# EAGLE design ATTiny85 (EAGLE 9.6.2)
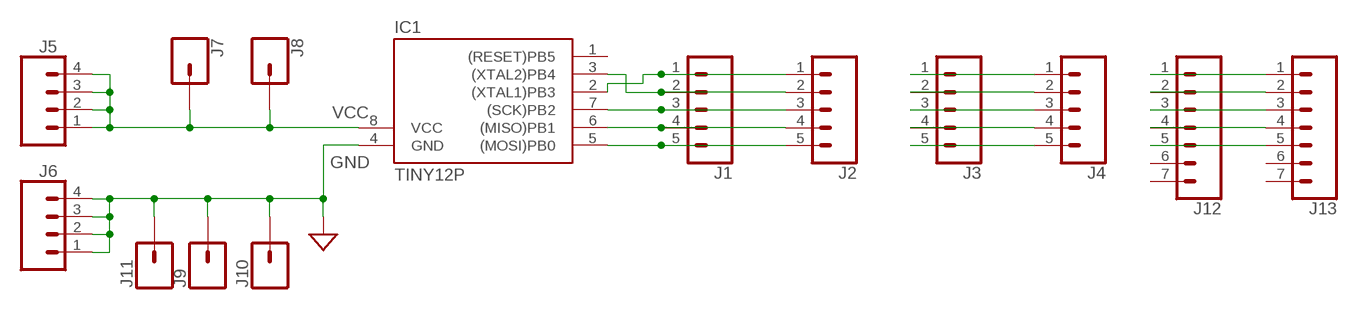
[diagram p0: schematic, sheet 1]

## Parts
IC1  TINY12P  [DIL08]
J1  CONN_05NO_SILK  [1X05_NO_SILK]
J2  CONN_05NO_SILK  [1X05_NO_SILK]
J3  CONN_05NO_SILK  [1X05_NO_SILK]
J4  CONN_05NO_SILK  [1X05_NO_SILK]
J5  CONN_041X04_NO_SILK  [1X04_NO_SILK]
J6  CONN_041X04_NO_SILK  [1X04_NO_SILK]
J7  CONN_01PTH_NO_SILK_KIT  [1X01NS_KIT]
J8  CONN_01PTH_NO_SILK_KIT  [1X01NS_KIT]
J9  CONN_01PTH_NO_SILK_KIT  [1X01NS_KIT]
J10  CONN_01PTH_NO_SILK_KIT  [1X01NS_KIT]
J11  CONN_01PTH_NO_SILK_KIT  [1X01NS_KIT]
J12  CONN_07NO_SILK  [1X07_NO_SILK]
J13  CONN_07NO_SILK  [1X07_NO_SILK]

## Nets
GND: IC1.4(GND) J6.1 J6.2 J6.3 J6.4 J9.1 J10.1 J11.1
N$1: J3.1 J4.1
N$2: J3.2 J4.2
N$3: IC1.2((XTAL1)PB3) J1.1 J2.1
N$4: IC1.3((XTAL2)PB4) J1.2 J2.2
N$5: IC1.7((SCK)PB2) J1.3 J2.3
N$6: IC1.6((MISO)PB1) J1.4 J2.4
N$7: IC1.5((MOSI)PB0) J1.5 J2.5
N$8: J3.3 J4.3
N$9: J3.4 J4.4
N$10: J3.5 J4.5
N$11: J12.1 J13.1
N$12: J12.2 J13.2
N$13: J12.3 J13.3
N$14: J12.4 J13.4
N$15: J12.5 J13.5
VCC: IC1.8(VCC) J5.1 J5.2 J5.3 J5.4 J7.1 J8.1
Unconnected: IC1.1((RESET)PB5) J12.6 J12.7 J13.6 J13.7

## Library data of the parts
IC1 = atmel:TINY12*: MICROCONTROLLER 1 Kbytes FLASH 64 bytes EEPROM; OC_FARNELL: unknown; OC_NEWARK: unknown
J1-J4 = SparkFun-Connectors:CONN_05: Multi connection point. Often used as Generic Header-pin footprint for 0.1 inch spaced/style header connections On any of the 0.1 inch spaced packages, you can populate with these: Break Away Headers - Straight <https://www.sparkfun.com/products/116> (PRT-00116) Break Away Male Headers - Right Angle <https://www.sparkfun.com/products/553> (PRT-00553) Female Headers <https://www.sparkfun.com/products/115> (PRT-00115) Break Away Headers - Machine Pin <https://www.sparkfun.com/products/117> (PRT-00117) Break Away Female Headers - Swiss Machine Pin <https://www.sparkfun.com/products/743> (PRT-00743) For SCREWTERMINALS and SPRING TERMINALS visit here: Screw Terimnals on SparkFun.com <https://www.sparkfun.com/search/results?term=Screw+Terminals> (5mm/3.5mm/2.54mm spacing) This device is also useful as a general connection point to wire up your design to another part of your project. Our various solder wires solder well into these plated through hole pads. Hook-Up Wire - Assortment (Stranded, 22 AWG) <https://www.sparkfun.com/products/11375> (PRT-11375) Hook-Up Wire - Assortment (Solid Core, 22 AWG) <https://www.sparkfun.com/products/11367> (PRT-11367) View the entire wire category on our website here <https://www.sparkfun.com/categories/141> Special notes: Molex polarized connector foot print use with SKU : PRT-08231 with associated crimp pins and housings. 1MM SMD Version SKU: PRT-10208
J5 J6 = SparkFun-Connectors:CONN_04: Multi connection point. Often used as Generic Header-pin footprint for 0.1 inch spaced/style header connections On any of the 0.1 inch spaced packages, you can populate with these: Break Away Headers - Straight <https://www.sparkfun.com/products/116> (PRT-00116) Break Away Male Headers - Right Angle <https://www.sparkfun.com/products/553> (PRT-00553) Female Headers <https://www.sparkfun.com/products/115> (PRT-00115) Break Away Headers - Machine Pin <https://www.sparkfun.com/products/117> (PRT-00117) Break Away Female Headers - Swiss Machine Pin <https://www.sparkfun.com/products/743> (PRT-00743) For SCREWTERMINALS and SPRING TERMINALS visit here: Screw Terimnals on SparkFun.com <https://www.sparkfun.com/search/results?term=Screw+Terminals> (5mm/3.5mm/2.54mm spacing) This device is also useful as a general connection point to wire up your design to another part of your project. Our various solder wires solder well into these plated through hole pads. Hook-Up Wire - Assortment (Stranded, 22 AWG) <https://www.sparkfun.com/products/11375> (PRT-11375) Hook-Up Wire - Assortment (Solid Core, 22 AWG) <https://www.sparkfun.com/products/11367> (PRT-11367) View the entire wire category on our website here <https://www.sparkfun.com/categories/141> Special notes: Molex polarized connector foot print use with SKU : PRT-08231 with associated crimp pins and housings. 1MM SMD Version SKU: PRT-10208; PROD_ID: CONN-09696
J7-J11 = SparkFun-Connectors:CONN_01: Single connection point. Often used as Generic Header-pin footprint for 0.1 inch spaced/style header connections On any of the 0.1 inch spaced packages, you can populate with these: Break Away Headers - Straight <https://www.sparkfun.com/products/116> (PRT-00116) Break Away Male Headers - Right Angle <https://www.sparkfun.com/products/553> (PRT-00553) Female Headers <https://www.sparkfun.com/products/115> (PRT-00115) Break Away Headers - Machine Pin <https://www.sparkfun.com/products/117> (PRT-00117) Break Away Female Headers - Swiss Machine Pin <https://www.sparkfun.com/products/743> (PRT-00743) This device is also useful as a general connection point to wire up your design to another part of your project. Our various solder wires solder well into these plated through hole pads. Hook-Up Wire - Assortment (Stranded, 22 AWG) <https://www.sparkfun.com/products/11375> (PRT-11375) Hook-Up Wire - Assortment (Solid Core, 22 AWG) <https://www.sparkfun.com/products/11367> (PRT-11367) View the entire wire category on our website here <https://www.sparkfun.com/categories/141> Special notes: SMTSO-256-ET is a "flush mount" nut for a 4-40 screw. We mostly use this on specialty testbeds; it is a nice way to connect hardware to your PCB at an adjustable hieght. Also note, the SNAP packages are for using a snappable style connector. We sell a baggie of snaps and they are also used on two LilyPad designs: Snap Assortment - 30 pack (male and female) <https://www.sparkfun.com/products/11347> (DEV-11347) LilyPad Arduino SimpleSnap <https://www.sparkfun.com/products/10941> (DEV-10941) LilyPad SimpleSnap Protoboard <https://www.sparkfun.com/products/10940> (DEV-10940)
J12 J13 = SparkFun-Connectors:CONN_07: Multi connection point. Often used as Generic Header-pin footprint for 0.1 inch spaced/style header connections On any of the 0.1 inch spaced packages, you can populate with these: Break Away Headers - Straight <https://www.sparkfun.com/products/116> (PRT-00116) Break Away Male Headers - Right Angle <https://www.sparkfun.com/products/553> (PRT-00553) Female Headers <https://www.sparkfun.com/products/115> (PRT-00115) Break Away Headers - Machine Pin <https://www.sparkfun.com/products/117> (PRT-00117) Break Away Female Headers - Swiss Machine Pin <https://www.sparkfun.com/products/743> (PRT-00743) For SCREWTERMINALS and SPRING TERMINALS visit here: Screw Terimnals on SparkFun.com <https://www.sparkfun.com/search/results?term=Screw+Terminals> (5mm/3.5mm/2.54mm spacing) This device is also useful as a general connection point to wire up your design to another part of your project. Our various solder wires solder well into these plated through hole pads. Hook-Up Wire - Assortment (Stranded, 22 AWG) <https://www.sparkfun.com/products/11375> (PRT-11375) Hook-Up Wire - Assortment (Solid Core, 22 AWG) <https://www.sparkfun.com/products/11367> (PRT-11367) View the entire wire category on our website here <https://www.sparkfun.com/categories/141> Special notes: Molex polarized connector foot print use with SKU : PRT-08231 with associated crimp pins and housings. 1MM SMD Version SKU: PRT-10208 NOTES ON THE VARIANTS LOCK and LOCK_LONGPADS... This footprint was designed to help hold the alignment of a through-hole component (i.e. 6-pin header) while soldering it into place. You may notice that each hole has been shifted either up or down by 0.005 of an inch from it's more standard position (which is a perfectly straight line). This slight alteration caused the pins (the squares in the middle) to touch the edges of the holes. Because they are alternating, it causes a "brace" to hold the component in place. 0.005 has proven to be the perfect amount of "off-center" position when using our standard breakaway headers. Although looks a little odd when you look at the bare footprint, once you have a header in there, the alteration is very hard to notice. Also,if you push a header all the way into place, it is covered up entirely on the bottom side.

## Board
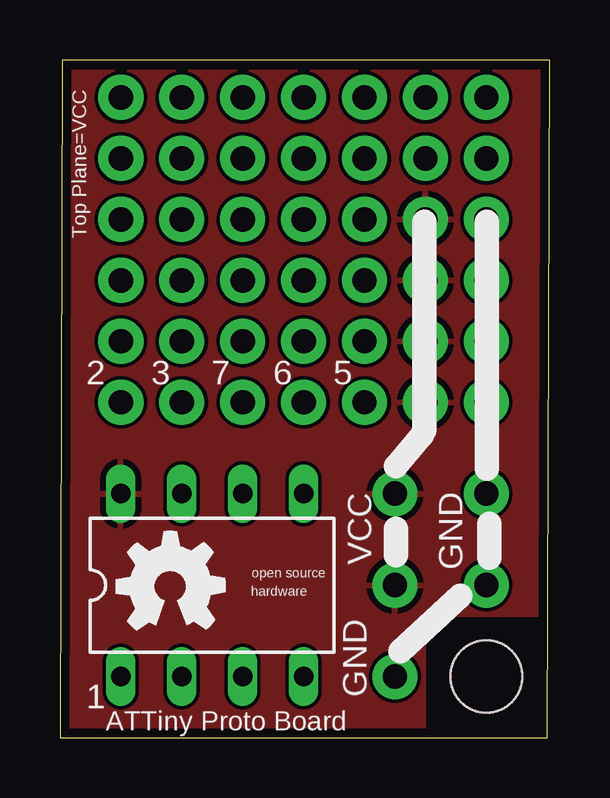
[diagram p1: board, top side]
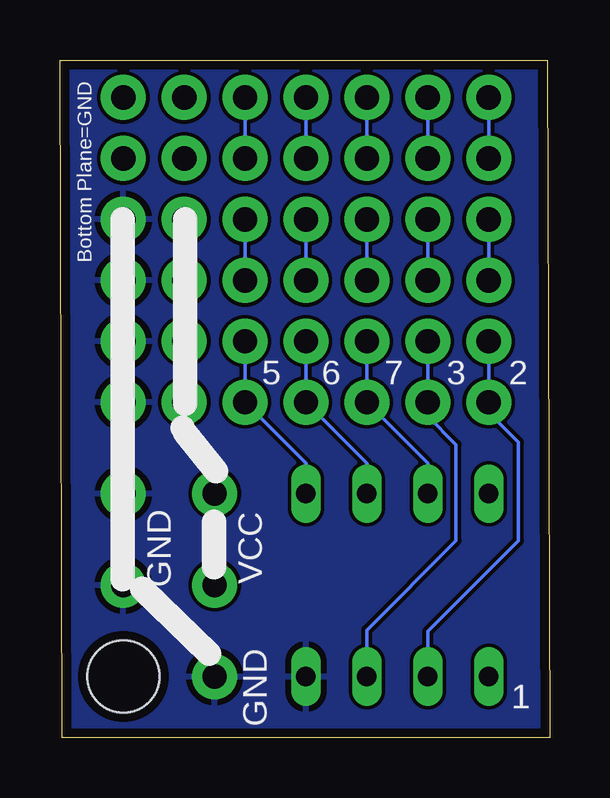
[diagram p2: board, bottom side, seen from below]

Size 20.42 x 28.23 mm. Coordinates in mm from the lower left corner, seen from the top.
Outline: 0,0 20.32,0 20.42,28.23 0.1,28.23 0,0
Copper layers (1*16): Top 0.035559375mm / dielectric 1.6mm / Bottom 0.035559375mm
Design rules "oshpark-2layer": minimum track width 6mil, minimum drill 10mil, track to track 6mil, track to pad 6mil, pad to pad 6mil, via to via 6mil, smd to smd 6mil, copper to edge 15mil, drill to drill 6mil, minimum pad ring 5mil, minimum via ring 5mil, stop-mask expansion 2.5mil, vias tented up to drill 0mil, thermal gap 10mil
Holes 3 mm at 17.78,2.54

### Footprints (pad centres in the part's own frame; a part is rotated, then mirrored left to right if it is on the bottom)
DIL08 = drill 0.813 long: 1 -3.81,-3.81; 2 -1.27,-3.81; 3 1.27,-3.81; 4 3.81,-3.81; 5 3.81,3.81; 6 1.27,3.81; 7 -1.27,3.81; 8 -3.81,3.81
1X05_NO_SILK = drill 1.016 pad 1.88: 1 0,0; 2 2.54,0; 3 5.08,0; 4 7.62,0; 5 10.16,0
1X04_NO_SILK = drill 1.016 pad 1.88: 1 0,0; 2 2.54,0; 3 5.08,0; 4 7.62,0
1X01NS_KIT = drill 1.016 pad 1.88: 1 0,0
1X07_NO_SILK = drill 1.016 pad 1.88: 1 0,0; 2 2.54,0; 3 5.08,0; 4 7.62,0; 5 10.16,0; 6 12.7,0; 7 15.24,0

### Placement (x,y rotation side)
IC1  6.35,6.35 0 top
J1  2.54,13.97 0 top
J2  2.54,16.51 0 top
J3  2.54,19.05 0 top
J4  2.54,21.59 0 top
J5  15.24,13.97 90 top
J6  17.78,13.97 90 top
J7  13.97,10.16 0 top
J8  13.97,6.35 0 top
J9  17.78,6.35 0 top
J10  17.78,10.16 0 top
J11  13.97,2.54 0 top
J12  2.54,24.13 0 top
J13  2.54,26.67 0 top
U$1  [OSHW_5MM]  4.6,6.3 0 top

### Tracks (layer width: path | path; a pad name or v marks a point on that pad's centre or on a via)
GND
  pour Bottom: 0,0 0,28.2 20.4,28.2 20.4,0
N$1
  Bottom 0.152: J3.1 J4.1
N$2
  Bottom 0.152: J4.2 J3.2
N$3
  Bottom 0.152: IC1.2 5.08,4.42 1.3,8.2 1.3,12.3 2.54,13.54 J1.1 J2.1
N$4
  Bottom 0.152: IC1.3 7.62,4.48 3.9,8.2 3.9,12.2 5.1,13.4 5.1,13.95 J1.2 J2.2
N$5
  Bottom 0.152: IC1.7 5.08,11.43 J1.3 J2.3
N$6
  Bottom 0.152: IC1.6 7.62,11.43 J1.4 J2.4
N$7
  Bottom 0.152: IC1.5 10.16,11.43 J1.5 J2.5
N$8
  Bottom 0.152: J3.3 J4.3
N$9
  Bottom 0.152: J4.4 J3.4
N$10
  Bottom 0.152: J3.5 J4.5
N$11
  Bottom 0.152: J13.1 J12.1
N$12
  Bottom 0.152: J13.2 J12.2
N$13
  Bottom 0.152: J12.3 J13.3
N$14
  Bottom 0.152: J13.4 J12.4
N$15
  Bottom 0.152: J12.5 J13.5
VCC
  pour Top: 0,0 0,28.2 20.4,28.2 20.4,5.1 15.2,5.1 15.2,0

### Text on the board
tPlace: Top Plane=VCC | 2 | 3 | 7 | 6 | 5 | VCC | GND | GND | 1 | ATTiny Proto Board
bPlace: Bottom Plane=GND | 2 | 3 | 7 | 6 | 5 | GND | VCC | GND | 1